# Altium schematic sheet PERIPHERALS.SchDoc
size A4; DocumentNumber: 43; SheetNumber: 43; SheetTotal: 47
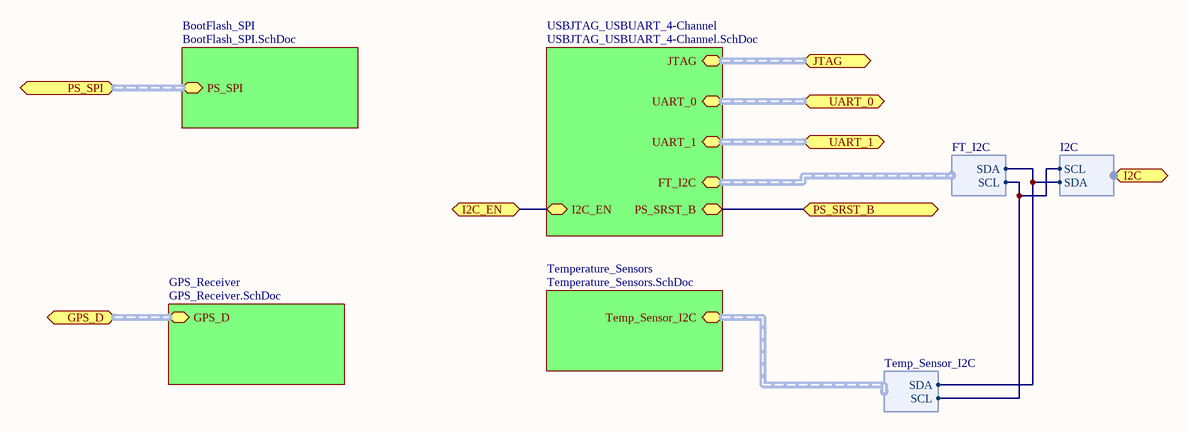
[diagram p0: PERIPHERALS.SchDoc]

## Sub-sheets
BootFlash_SPI = BootFlash_SPI.SchDoc: PS_SPI (harness SPI)
GPS_Receiver = GPS_Receiver.SchDoc: GPS_D (harness GPS)
Temperature_Sensors = Temperature_Sensors.SchDoc: Temp_Sensor_I2C (harness Temp_Sensor_I2C)
USBJTAG_USBUART_4-Channel = USBJTAG_USBUART_4-Channel.SchDoc: JTAG (harness JTAG), UART_0 (harness UART_0), UART_1 (harness UART_1), PS_SRST_B (bidir), FT_I2C (harness FT_I2C), I2C_EN

## Ports
GPS_D (harness GPS), I2C (harness I2C), I2C_EN (bidir), JTAG (harness JTAG), PS_SPI (harness SPI), PS_SRST_B (bidir), UART_0 (harness UART_0), UART_1 (harness UART_1)

## Harnesses
I2C: SCL, SDA
Temp_Sensor_I2C: SCL, SDA
FT_I2C: SCL, SDA

## Nets
I2C_EN: port I2C_EN, sheet USBJTAG_USBUART_4-Channel/I2C_EN
PS_SRST_B: port PS_SRST_B, sheet USBJTAG_USBUART_4-Channel/PS_SRST_B
(unnamed): port I2C.SCL, sheet Temperature_Sensors/Temp_Sensor_I2C.SCL, sheet USBJTAG_USBUART_4-Channel/FT_I2C.SCL
(unnamed): port I2C.SDA, sheet Temperature_Sensors/Temp_Sensor_I2C.SDA, sheet USBJTAG_USBUART_4-Channel/FT_I2C.SDA

## Buses and harness runs
harness port GPS_D = sheet GPS_Receiver/GPS_D
harness port JTAG = sheet USBJTAG_USBUART_4-Channel/JTAG
harness port PS_SPI = sheet BootFlash_SPI/PS_SPI
harness port UART_0 = sheet USBJTAG_USBUART_4-Channel/UART_0
harness port UART_1 = sheet USBJTAG_USBUART_4-Channel/UART_1